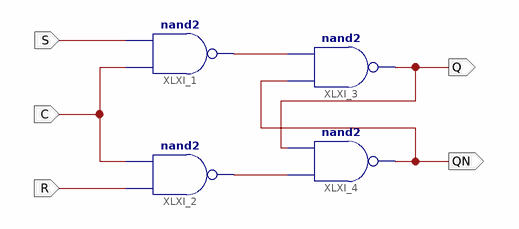
[diagram p0: schematic sheet 1]
// Xilinx ISE schematic CSR_LATCH.sch (kintex7) as structural Verilog: 4 symbols, 5 ports
module CSR_LATCH (
  input  S,
  input  C,
  input  R,
  output Q,
  output QN
);

  wire XLXN_1, XLXN_2;

  nand XLXI_1 (XLXN_1, C, S);
  nand XLXI_2 (XLXN_2, R, C);
  nand XLXI_3 (Q, QN, XLXN_1);
  nand XLXI_4 (QN, XLXN_2, Q);
endmodule
